# Altium schematic sheet RcMPPT-Top.SchDoc: RcMPPT-Top SCC
size A4; Author: Thomas Hofmann; CompanyName: HTL St. Pölten; Organization: Altium Limited; Address1: RcMPPT; Address2: Frenchs Forest; Address3: NSW; Address4: Australia 2086; DocumentNumber: 1; Revision: 2.0; SheetNumber: 1; SheetTotal: 8
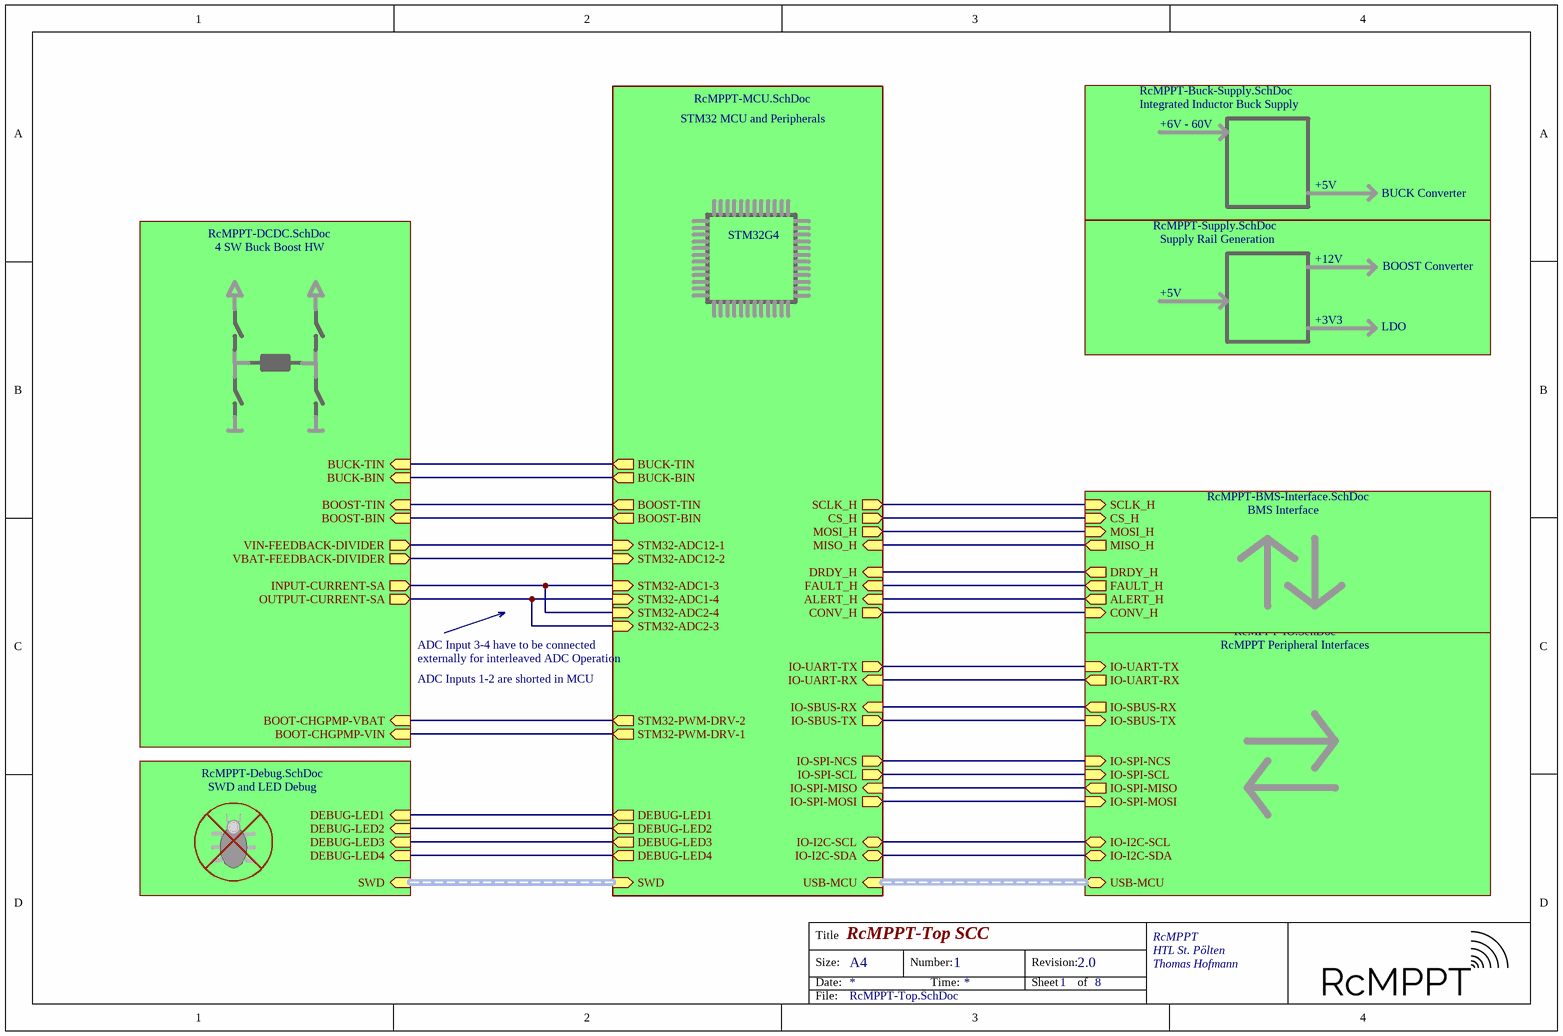
[diagram p0: RcMPPT-Top.SchDoc]

## Sub-sheets
4 SW Buck Boost HW = RcMPPT-DCDC.SchDoc: VBAT-FEEDBACK-DIVIDER (out), VIN-FEEDBACK-DIVIDER (out), BOOST-BIN (in), BOOST-TIN (in), BUCK-TIN (in), BUCK-BIN (in), OUTPUT-CURRENT-SA (out), INPUT-CURRENT-SA (out), BOOT-CHGPMP-VBAT (in), BOOT-CHGPMP-VIN (in)
BMS Interface = RcMPPT-BMS-Interface.SchDoc: DRDY_H (out), FAULT_H (out), SCLK_H (in), CS_H (in), MOSI_H (in), CONV_H (in), MISO_H (out), ALERT_H (out)
Integrated Inductor Buck Supply = RcMPPT-Buck-Supply.SchDoc: no entries
RcMPPT Peripheral Interfaces = RcMPPT-IO.SchDoc: USB-MCU (bidir, harness USB-HARNESS), IO-I2C-SDA (bidir), IO-I2C-SCL (bidir), IO-SPI-MOSI (in), IO-SPI-MISO (out), IO-SPI-SCL (in), IO-SPI-NCS (in), IO-SBUS-TX (in), IO-SBUS-RX (out), IO-UART-RX (out), IO-UART-TX (in)
STM32 MCU and Peripherals = RcMPPT-MCU.SchDoc: STM32-ADC12-2 (in), STM32-ADC12-1 (in), BOOST-BIN (out), BOOST-TIN (out), BUCK-BIN (out), BUCK-TIN (out), USB-MCU (in, harness USB-HARNESS), SWD (in, harness SWD-HARNESS), DEBUG-LED4 (out), DEBUG-LED3 (out), DEBUG-LED2 (out), DEBUG-LED1 (out), STM32-ADC2-4 (in), STM32-ADC2-3 (in), STM32-ADC1-4 (in), STM32-ADC1-3 (in), STM32-PWM-DRV-1 (out), STM32-PWM-DRV-2 (out), IO-I2C-SDA (bidir), IO-I2C-SCL (bidir), IO-SPI-MOSI (out), IO-SPI-MISO (in), IO-SPI-SCL (out), IO-SPI-NCS (out), IO-SBUS-TX (out), IO-SBUS-RX (in), IO-UART-RX (in), IO-UART-TX (out), DRDY_H (in), FAULT_H (in), SCLK_H (out), CS_H (out), MOSI_H (out), CONV_H (out), MISO_H (in), ALERT_H (in)
Supply Rail Generation = RcMPPT-Supply.SchDoc: no entries
SWD and LED Debug = RcMPPT-Debug.SchDoc: SWD (in, harness SWD-HARNESS), DEBUG-LED4 (in), DEBUG-LED3 (in), DEBUG-LED2 (in), DEBUG-LED1 (in)

## Nets
(unnamed): sheet 4 SW Buck Boost HW/VBAT-FEEDBACK-DIVIDER, sheet STM32 MCU and Peripherals/STM32-ADC12-2
(unnamed): sheet 4 SW Buck Boost HW/VIN-FEEDBACK-DIVIDER, sheet STM32 MCU and Peripherals/STM32-ADC12-1
(unnamed): sheet 4 SW Buck Boost HW/BOOST-BIN, sheet STM32 MCU and Peripherals/BOOST-BIN
(unnamed): sheet 4 SW Buck Boost HW/BOOST-TIN, sheet STM32 MCU and Peripherals/BOOST-TIN
(unnamed): sheet 4 SW Buck Boost HW/BUCK-TIN, sheet STM32 MCU and Peripherals/BUCK-TIN
(unnamed): sheet 4 SW Buck Boost HW/BUCK-BIN, sheet STM32 MCU and Peripherals/BUCK-BIN
(unnamed): sheet 4 SW Buck Boost HW/OUTPUT-CURRENT-SA, sheet STM32 MCU and Peripherals/STM32-ADC2-3, sheet STM32 MCU and Peripherals/STM32-ADC1-4
(unnamed): sheet 4 SW Buck Boost HW/INPUT-CURRENT-SA, sheet STM32 MCU and Peripherals/STM32-ADC2-4, sheet STM32 MCU and Peripherals/STM32-ADC1-3
(unnamed): sheet 4 SW Buck Boost HW/BOOT-CHGPMP-VBAT, sheet STM32 MCU and Peripherals/STM32-PWM-DRV-2
(unnamed): sheet 4 SW Buck Boost HW/BOOT-CHGPMP-VIN, sheet STM32 MCU and Peripherals/STM32-PWM-DRV-1
(unnamed): sheet RcMPPT Peripheral Interfaces/IO-I2C-SDA, sheet STM32 MCU and Peripherals/IO-I2C-SDA
(unnamed): sheet RcMPPT Peripheral Interfaces/IO-I2C-SCL, sheet STM32 MCU and Peripherals/IO-I2C-SCL
(unnamed): sheet RcMPPT Peripheral Interfaces/IO-SPI-MOSI, sheet STM32 MCU and Peripherals/IO-SPI-MOSI
(unnamed): sheet RcMPPT Peripheral Interfaces/IO-SPI-MISO, sheet STM32 MCU and Peripherals/IO-SPI-MISO
(unnamed): sheet RcMPPT Peripheral Interfaces/IO-SPI-SCL, sheet STM32 MCU and Peripherals/IO-SPI-SCL
(unnamed): sheet RcMPPT Peripheral Interfaces/IO-SPI-NCS, sheet STM32 MCU and Peripherals/IO-SPI-NCS
(unnamed): sheet RcMPPT Peripheral Interfaces/IO-SBUS-TX, sheet STM32 MCU and Peripherals/IO-SBUS-TX
(unnamed): sheet RcMPPT Peripheral Interfaces/IO-SBUS-RX, sheet STM32 MCU and Peripherals/IO-SBUS-RX
(unnamed): sheet RcMPPT Peripheral Interfaces/IO-UART-RX, sheet STM32 MCU and Peripherals/IO-UART-RX
(unnamed): sheet RcMPPT Peripheral Interfaces/IO-UART-TX, sheet STM32 MCU and Peripherals/IO-UART-TX
(unnamed): sheet STM32 MCU and Peripherals/DEBUG-LED4, sheet SWD and LED Debug/DEBUG-LED4
(unnamed): sheet STM32 MCU and Peripherals/DEBUG-LED3, sheet SWD and LED Debug/DEBUG-LED3
(unnamed): sheet STM32 MCU and Peripherals/DEBUG-LED2, sheet SWD and LED Debug/DEBUG-LED2
(unnamed): sheet STM32 MCU and Peripherals/DEBUG-LED1, sheet SWD and LED Debug/DEBUG-LED1
(unnamed): sheet STM32 MCU and Peripherals/DRDY_H, sheet BMS Interface/DRDY_H
(unnamed): sheet STM32 MCU and Peripherals/FAULT_H, sheet BMS Interface/FAULT_H
(unnamed): sheet STM32 MCU and Peripherals/SCLK_H, sheet BMS Interface/SCLK_H
(unnamed): sheet STM32 MCU and Peripherals/CS_H, sheet BMS Interface/CS_H
(unnamed): sheet STM32 MCU and Peripherals/MOSI_H, sheet BMS Interface/MOSI_H
(unnamed): sheet STM32 MCU and Peripherals/CONV_H, sheet BMS Interface/CONV_H
(unnamed): sheet STM32 MCU and Peripherals/MISO_H, sheet BMS Interface/MISO_H
(unnamed): sheet STM32 MCU and Peripherals/ALERT_H, sheet BMS Interface/ALERT_H

## Buses and harness runs
harness sheet RcMPPT Peripheral Interfaces/USB-MCU = sheet STM32 MCU and Peripherals/USB-MCU
harness sheet STM32 MCU and Peripherals/SWD = sheet SWD and LED Debug/SWD

## Notes on the sheet
- +6V - 60V
- STM32G4
- +5V
- BUCK Converter
- +12V
- BOOST Converter
- +3V3
- LDO
- ADC Input 3-4 have to be connected
- ADC Inputs 1-2 are shorted in MCU
- externally for interleaved ADC Operation
- Title
- Size:
- Date:
- A4
- Number:
- Time:
- Revision:
- Sheet
- of
- RcMPPT
- File: